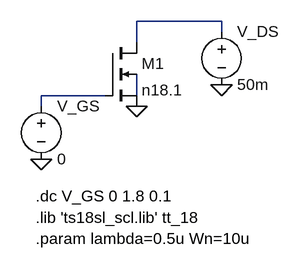
[diagram p0: schematic 2_a.asc]
2_a.asc, the LTspice schematic file:
Version 4
SHEET 1 980 680
WIRE 432 -80 304 -80
WIRE 432 -64 432 -80
WIRE 304 -48 304 -80
WIRE 256 32 160 32
WIRE 304 32 304 0
WIRE 160 48 160 32
FLAG 160 128 0
FLAG 304 48 0
FLAG 432 16 0
SYMBOL voltage 160 32 R0
WINDOW 123 0 0 Left 0
WINDOW 39 0 0 Left 0
SYMATTR InstName V_GS
SYMATTR Value 0
SYMBOL voltage 432 -80 R0
WINDOW 123 0 0 Left 0
WINDOW 39 0 0 Left 0
SYMATTR InstName V_DS
SYMATTR Value 50m
SYMBOL nmos4 256 -48 R0
SYMATTR InstName M1
SYMATTR Value n18.1
SYMATTR Value2 l={2*lambda} w={Wn} ad={5*lambda*Wn} as={5*lambda*Wn} pd={2*Wn + 10*lambda} ps={2*Wn + 10*lambda}
TEXT 152 184 Left 2 !.dc V_GS 0 1.8 0.1
TEXT 152 248 Left 2 !.param lambda=0.5u Wn=10u
TEXT 152 216 Left 2 !.lib 'ts18sl_scl.lib' tt_18

The netlist it stands for:
* 2_a.asc
V_GS N002 0 0
V_DS N001 0 50m
M1 N001 N002 0 N003 n18.1 l={2*lambda} w={Wn} ad={5*lambda*Wn} as={5*lambda*Wn} pd={2*Wn + 10*lambda} ps={2*Wn + 10*lambda}
.model NMOS NMOS
.model PMOS PMOS
.lib standard.mos
.dc V_GS 0 1.8 0.1
.param lambda=0.5u Wn=10u
.lib 'ts18sl_scl.lib' tt_18
.backanno
.end